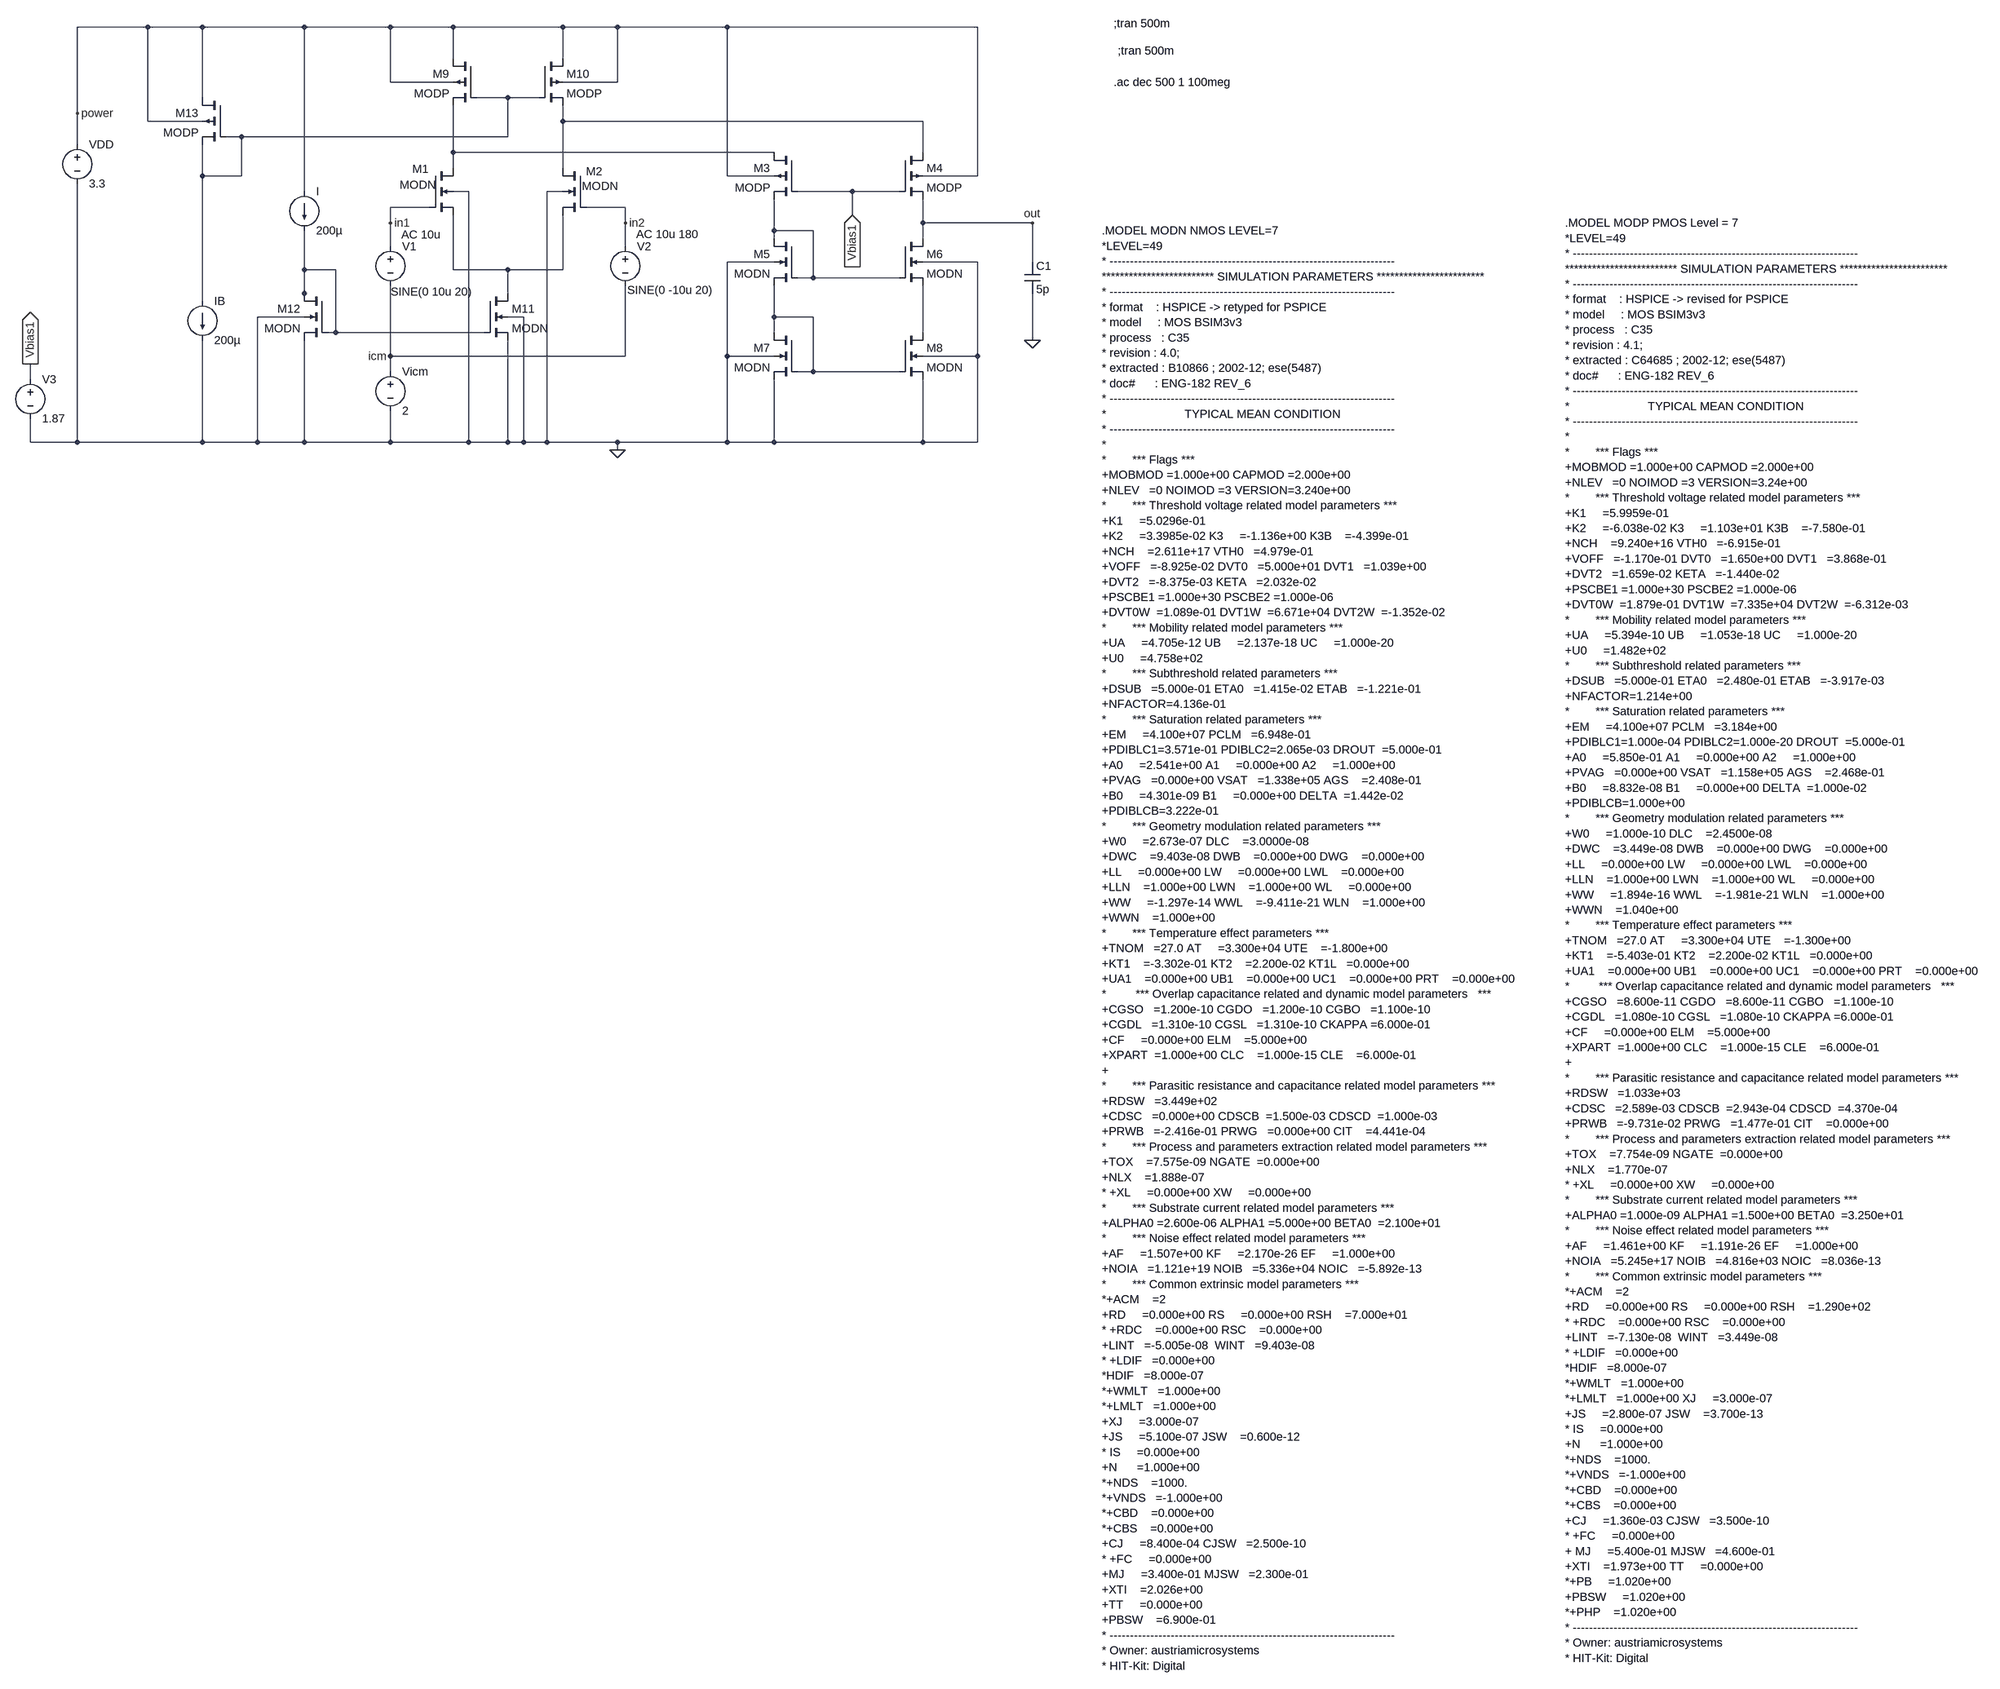
[diagram p0: schematic MyOta.asc]
MyOta.asc, the LTspice schematic file:
Version 4
SHEET 1 2372 2896
WIRE -1664 -192 -1808 -192
WIRE -1552 -192 -1664 -192
WIRE -1344 -192 -1552 -192
WIRE -1168 -192 -1344 -192
WIRE -1040 -192 -1168 -192
WIRE -928 -192 -1040 -192
WIRE -816 -192 -928 -192
WIRE -704 -192 -816 -192
WIRE -480 -192 -704 -192
WIRE 32 -192 -480 -192
WIRE -1808 -128 -1808 -192
WIRE -1040 -128 -1040 -192
WIRE -816 -128 -816 -192
WIRE -1552 -96 -1552 -192
WIRE -1168 -80 -1168 -192
WIRE -1040 -80 -1168 -80
WIRE -704 -80 -704 -192
WIRE -704 -80 -816 -80
WIRE -1552 -48 -1552 -96
WIRE -928 -48 -992 -48
WIRE -864 -48 -928 -48
WIRE -1808 -16 -1808 -128
WIRE -1040 -16 -1040 -32
WIRE -816 -16 -816 -32
WIRE -1664 0 -1664 -192
WIRE -1552 0 -1664 0
WIRE -816 0 -816 -16
WIRE -592 0 -816 0
WIRE -112 0 -592 0
WIRE -80 0 -112 0
WIRE -1472 32 -1504 32
WIRE -928 32 -928 -48
WIRE -928 32 -1472 32
WIRE -1808 48 -1808 -16
WIRE -1040 64 -1040 -16
WIRE -592 64 -1040 64
WIRE -432 64 -592 64
WIRE -384 64 -432 64
WIRE -80 64 -80 0
WIRE -1040 96 -1040 64
WIRE -816 96 -816 0
WIRE -1552 112 -1552 48
WIRE -1472 112 -1472 32
WIRE -1472 112 -1552 112
WIRE -480 112 -480 -192
WIRE -384 112 -480 112
WIRE 32 112 32 -192
WIRE 32 112 -80 112
WIRE -1344 144 -1344 -192
WIRE -1008 144 -1040 144
WIRE -816 144 -848 144
WIRE -224 144 -336 144
WIRE -128 144 -224 144
WIRE -1152 176 -1168 176
WIRE -1088 176 -1152 176
WIRE -704 176 -768 176
WIRE -688 176 -704 176
WIRE -224 192 -224 144
WIRE -1168 208 -1168 176
WIRE -688 208 -688 176
WIRE -384 208 -384 160
WIRE -80 208 -80 160
WIRE 32 208 -80 208
WIRE 144 208 32 208
WIRE -384 224 -384 208
WIRE -304 224 -384 224
WIRE -384 240 -384 224
WIRE -80 240 -80 208
WIRE -1168 256 -1168 208
WIRE -1040 256 -1040 192
WIRE -816 256 -816 192
WIRE -688 256 -688 208
WIRE -384 288 -480 288
WIRE 32 288 -80 288
WIRE 144 288 144 208
WIRE -1344 304 -1344 224
WIRE -1280 304 -1344 304
WIRE -1040 304 -1040 256
WIRE -928 304 -1040 304
WIRE -816 304 -816 256
WIRE -816 304 -928 304
WIRE -304 320 -304 224
WIRE -304 320 -336 320
WIRE -224 320 -304 320
WIRE -128 320 -224 320
WIRE -1344 352 -1344 304
WIRE -928 352 -928 304
WIRE -1552 368 -1552 112
WIRE -1344 368 -1344 352
WIRE -384 368 -384 336
WIRE -80 368 -80 336
WIRE -1344 400 -1440 400
WIRE -896 400 -928 400
WIRE -384 400 -384 368
WIRE -304 400 -384 400
WIRE -1280 432 -1280 304
WIRE -1280 432 -1296 432
WIRE -1088 432 -1280 432
WIRE -976 432 -1088 432
WIRE -384 432 -384 400
WIRE -80 432 -80 368
WIRE 144 448 144 352
WIRE -1168 480 -1168 336
WIRE -688 480 -688 336
WIRE -688 480 -1168 480
WIRE -480 480 -480 288
WIRE -384 480 -480 480
WIRE 32 480 32 288
WIRE 32 480 -80 480
WIRE -1168 512 -1168 480
WIRE -304 512 -304 400
WIRE -304 512 -336 512
WIRE -224 512 -304 512
WIRE -128 512 -224 512
WIRE -1904 528 -1904 496
WIRE -1344 528 -1344 448
WIRE -928 560 -928 448
WIRE -1904 656 -1904 608
WIRE -1808 656 -1808 128
WIRE -1808 656 -1904 656
WIRE -1552 656 -1552 448
WIRE -1552 656 -1808 656
WIRE -1440 656 -1440 400
WIRE -1440 656 -1552 656
WIRE -1344 656 -1344 528
WIRE -1344 656 -1440 656
WIRE -1168 656 -1168 592
WIRE -1168 656 -1344 656
WIRE -1008 656 -1008 144
WIRE -1008 656 -1168 656
WIRE -928 656 -928 560
WIRE -928 656 -1008 656
WIRE -896 656 -896 400
WIRE -896 656 -928 656
WIRE -848 656 -848 144
WIRE -848 656 -896 656
WIRE -704 656 -848 656
WIRE -480 656 -480 480
WIRE -480 656 -704 656
WIRE -384 656 -384 528
WIRE -384 656 -480 656
WIRE -80 656 -80 528
WIRE -80 656 -384 656
WIRE 32 656 32 480
WIRE 32 656 -80 656
WIRE -704 672 -704 656
FLAG -704 672 0
FLAG -224 192 Vbias1
IOPIN -224 192 In
FLAG 144 208 out
FLAG -1904 496 Vbias1
IOPIN -1904 496 Out
FLAG 144 448 0
FLAG -688 208 in2
FLAG -1168 208 in1
FLAG -1168 480 icm
FLAG -1808 -16 power
DATAFLAG -592 0 "round(-Is(M4)*1meg)/1meg"
DATAFLAG -592 64 "round(-Is(M3)*1meg)/1meg"
DATAFLAG -816 256 "round(-Is(M2)*1meg)/1meg"
DATAFLAG -1040 256 "round(-Is(M1)*1meg)/1meg"
DATAFLAG -1040 -16 "round(Id(M9)*1meg)/1meg"
DATAFLAG -816 -16 "round(Id(M10)*1meg)/1meg"
DATAFLAG -928 560 "round(Id(M11)*1meg)/1meg"
DATAFLAG -384 208 "round(-Is(M5)*1meg)/1meg"
DATAFLAG -1344 528 "round(Id(M12)*1meg)/1meg"
DATAFLAG -80 368 "round(-Is(M8)*1meg)/1meg"
DATAFLAG -384 368 "round(-Is(M7)*1meg)/1meg"
DATAFLAG -1552 -96 "round(-Is(M13)*1meg)/1meg"
DATAFLAG -928 304 "round(V(n005)*100)/100"
DATAFLAG -432 64 "round(V(n002)*100)/100"
DATAFLAG -112 0 "round(V(n003)*100)/100"
DATAFLAG -1088 432 "round(V(n006)*100)/100"
DATAFLAG -224 512 "round(V(n007)*100)/100"
DATAFLAG -224 320 "round(V(n004)*100)/100"
DATAFLAG 32 208 "round(V(out)*100)/100"
DATAFLAG -928 -192 ""
DATAFLAG -224 144 ""
DATAFLAG -928 -48 "round(V(n001)*100)/100"
DATAFLAG -704 176 ""
DATAFLAG -1152 176 ""
DATAFLAG -1808 -128 "-round(I(Vdd)*1meg)/1meg"
SYMBOL nmos4 -768 96 M0
WINDOW 0 -34 7 Left 2
WINDOW 3 -65 37 Left 2
SYMATTR InstName M2
SYMATTR Value MODN
SYMATTR Value2 l=1.4u w=36.4u
SYMBOL nmos4 -1088 96 R0
WINDOW 0 -35 2 Left 2
WINDOW 3 -61 34 Left 2
SYMATTR InstName M1
SYMATTR Value MODN
SYMATTR Value2 l=1.4u w=36.4u
SYMBOL pmos4 -128 64 R0
SYMATTR InstName M4
SYMATTR Value MODP
SYMATTR Value2 l=1.4u w=92.4u
SYMBOL nmos4 -128 240 R0
SYMATTR InstName M6
SYMATTR Value MODN
SYMATTR Value2 l=1.4u w=36.4u
SYMBOL nmos4 -128 432 R0
SYMATTR InstName M8
SYMATTR Value MODN
SYMATTR Value2 l=1.4u w=36.4u
SYMBOL pmos4 -864 -128 R0
SYMATTR InstName M10
SYMATTR Value MODP
SYMATTR Value2 l=1.4u w=184.8u
SYMBOL nmos4 -976 352 R0
SYMATTR InstName M11
SYMATTR Value MODN
SYMATTR Value2 l=1.4u w=72.8u
SYMBOL voltage -1808 32 R0
WINDOW 123 0 0 Left 2
WINDOW 39 0 0 Left 2
SYMATTR InstName VDD
SYMATTR Value 3.3
SYMBOL pmos4 -336 64 M0
SYMATTR InstName M3
SYMATTR Value MODP
SYMATTR Value2 l=1.4u w=92.4u
SYMBOL pmos4 -992 -128 M0
SYMATTR InstName M9
SYMATTR Value MODP
SYMATTR Value2 l=1.4u w=184.8u
SYMBOL nmos4 -336 240 M0
SYMATTR InstName M5
SYMATTR Value MODN
SYMATTR Value2 l=1.4u w=36.4u
SYMBOL nmos4 -336 432 M0
SYMATTR InstName M7
SYMATTR Value MODN
SYMATTR Value2 l=1.4u w=36.4u
SYMBOL nmos4 -1296 352 M0
SYMATTR InstName M12
SYMATTR Value MODN
SYMATTR Value2 l=1.4u w=72.8u
SYMBOL current -1344 144 R0
WINDOW 123 0 0 Left 2
WINDOW 39 0 0 Left 2
SYMATTR InstName I
SYMATTR Value 200µ
SYMBOL pmos4 -1504 -48 M0
SYMATTR InstName M13
SYMATTR Value MODP
SYMATTR Value2 l=1.4u w=184.8u
SYMBOL current -1552 368 R0
WINDOW 123 0 0 Left 2
WINDOW 39 0 0 Left 2
SYMATTR InstName IB
SYMATTR Value 200µ
SYMBOL voltage -1168 496 R0
WINDOW 123 24 124 Left 2
WINDOW 39 0 0 Left 2
SYMATTR InstName Vicm
SYMATTR Value 2
SYMBOL voltage -1168 240 R0
WINDOW 123 22 -8 Left 2
WINDOW 39 0 0 Left 2
WINDOW 3 1 109 Left 2
SYMATTR Value2 AC 10u
SYMATTR Value SINE(0 10u 20)
SYMATTR InstName V1
SYMBOL voltage -688 240 R0
WINDOW 3 4 105 Left 2
WINDOW 123 22 -9 Left 2
WINDOW 39 0 0 Left 2
SYMATTR Value SINE(0 -10u 20)
SYMATTR Value2 AC 10u 180
SYMATTR InstName V2
SYMBOL voltage -1904 512 R0
WINDOW 123 0 0 Left 2
WINDOW 39 0 0 Left 2
SYMATTR InstName V3
SYMATTR Value 1.87
SYMBOL cap 128 288 R0
SYMATTR InstName C1
SYMATTR Value 5p
TEXT 448 224 Left 2 !.MODEL MODN NMOS LEVEL=7\n*LEVEL=49 \n* ----------------------------------------------------------------------\n************************* SIMULATION PARAMETERS ************************\n* ----------------------------------------------------------------------\n* format    : HSPICE -> retyped for PSPICE\n* model     : MOS BSIM3v3\n* process   : C35\n* revision : 4.0; \n* extracted : B10866 ; 2002-12; ese(5487)\n* doc#      : ENG-182 REV_6\n* ----------------------------------------------------------------------\n*                        TYPICAL MEAN CONDITION\n* ----------------------------------------------------------------------\n*\n*        *** Flags ***\n+MOBMOD =1.000e+00 CAPMOD =2.000e+00 \n+NLEV   =0 NOIMOD =3 VERSION=3.240e+00 \n*        *** Threshold voltage related model parameters ***\n+K1     =5.0296e-01 \n+K2     =3.3985e-02 K3     =-1.136e+00 K3B    =-4.399e-01 \n+NCH    =2.611e+17 VTH0   =4.979e-01 \n+VOFF   =-8.925e-02 DVT0   =5.000e+01 DVT1   =1.039e+00 \n+DVT2   =-8.375e-03 KETA   =2.032e-02 \n+PSCBE1 =1.000e+30 PSCBE2 =1.000e-06 \n+DVT0W  =1.089e-01 DVT1W  =6.671e+04 DVT2W  =-1.352e-02 \n*        *** Mobility related model parameters ***\n+UA     =4.705e-12 UB     =2.137e-18 UC     =1.000e-20 \n+U0     =4.758e+02 \n*        *** Subthreshold related parameters ***\n+DSUB   =5.000e-01 ETA0   =1.415e-02 ETAB   =-1.221e-01 \n+NFACTOR=4.136e-01 \n*        *** Saturation related parameters ***\n+EM     =4.100e+07 PCLM   =6.948e-01 \n+PDIBLC1=3.571e-01 PDIBLC2=2.065e-03 DROUT  =5.000e-01 \n+A0     =2.541e+00 A1     =0.000e+00 A2     =1.000e+00 \n+PVAG   =0.000e+00 VSAT   =1.338e+05 AGS    =2.408e-01 \n+B0     =4.301e-09 B1     =0.000e+00 DELTA  =1.442e-02 \n+PDIBLCB=3.222e-01 \n*        *** Geometry modulation related parameters ***\n+W0     =2.673e-07 DLC    =3.0000e-08 \n+DWC    =9.403e-08 DWB    =0.000e+00 DWG    =0.000e+00 \n+LL     =0.000e+00 LW     =0.000e+00 LWL    =0.000e+00 \n+LLN    =1.000e+00 LWN    =1.000e+00 WL     =0.000e+00 \n+WW     =-1.297e-14 WWL    =-9.411e-21 WLN    =1.000e+00 \n+WWN    =1.000e+00 \n*        *** Temperature effect parameters ***\n+TNOM   =27.0 AT     =3.300e+04 UTE    =-1.800e+00 \n+KT1    =-3.302e-01 KT2    =2.200e-02 KT1L   =0.000e+00 \n+UA1    =0.000e+00 UB1    =0.000e+00 UC1    =0.000e+00 PRT    =0.000e+00 \n*         *** Overlap capacitance related and dynamic model parameters   ***\n+CGSO   =1.200e-10 CGDO   =1.200e-10 CGBO   =1.100e-10 \n+CGDL   =1.310e-10 CGSL   =1.310e-10 CKAPPA =6.000e-01 \n+CF     =0.000e+00 ELM    =5.000e+00 \n+XPART  =1.000e+00 CLC    =1.000e-15 CLE    =6.000e-01 \n+\n*        *** Parasitic resistance and capacitance related model parameters ***\n+RDSW   =3.449e+02 \n+CDSC   =0.000e+00 CDSCB  =1.500e-03 CDSCD  =1.000e-03 \n+PRWB   =-2.416e-01 PRWG   =0.000e+00 CIT    =4.441e-04 \n*        *** Process and parameters extraction related model parameters ***\n+TOX    =7.575e-09 NGATE  =0.000e+00 \n+NLX    =1.888e-07 \n* +XL     =0.000e+00 XW     =0.000e+00 \n*        *** Substrate current related model parameters ***\n+ALPHA0 =2.600e-06 ALPHA1 =5.000e+00 BETA0  =2.100e+01 \n*        *** Noise effect related model parameters ***\n+AF     =1.507e+00 KF     =2.170e-26 EF     =1.000e+00 \n+NOIA   =1.121e+19 NOIB   =5.336e+04 NOIC   =-5.892e-13 \n*        *** Common extrinsic model parameters ***\n*+ACM    =2        \n+RD     =0.000e+00 RS     =0.000e+00 RSH    =7.000e+01 \n* +RDC    =0.000e+00 RSC    =0.000e+00 \n+LINT   =-5.005e-08  WINT   =9.403e-08 \n* +LDIF   =0.000e+00 \n*HDIF   =8.000e-07\n*+WMLT   =1.000e+00 \n*+LMLT   =1.000e+00 \n+XJ     =3.000e-07 \n+JS     =5.100e-07 JSW    =0.600e-12 \n* IS     =0.000e+00 \n+N      =1.000e+00 \n*+NDS    =1000. \n*+VNDS   =-1.000e+00 \n*+CBD    =0.000e+00 \n*+CBS    =0.000e+00 \n+CJ     =8.400e-04 CJSW   =2.500e-10 \n* +FC     =0.000e+00 \n+MJ     =3.400e-01 MJSW   =2.300e-01 \n+XTI    =2.026e+00 \n+TT     =0.000e+00 \n+PBSW    =6.900e-01 \n* ----------------------------------------------------------------------\n* Owner: austriamicrosystems\n* HIT-Kit: Digital
TEXT 1408 208 Left 2 !.MODEL MODP PMOS Level = 7\n*LEVEL=49 \n* ----------------------------------------------------------------------\n************************* SIMULATION PARAMETERS ************************\n* ----------------------------------------------------------------------\n* format    : HSPICE -> revised for PSPICE\n* model     : MOS BSIM3v3\n* process   : C35\n* revision : 4.1; \n* extracted : C64685 ; 2002-12; ese(5487)\n* doc#      : ENG-182 REV_6\n* ----------------------------------------------------------------------\n*                        TYPICAL MEAN CONDITION\n* ----------------------------------------------------------------------\n*\n*        *** Flags ***\n+MOBMOD =1.000e+00 CAPMOD =2.000e+00 \n+NLEV   =0 NOIMOD =3 VERSION=3.24e+00 \n*        *** Threshold voltage related model parameters ***\n+K1     =5.9959e-01 \n+K2     =-6.038e-02 K3     =1.103e+01 K3B    =-7.580e-01 \n+NCH    =9.240e+16 VTH0   =-6.915e-01 \n+VOFF   =-1.170e-01 DVT0   =1.650e+00 DVT1   =3.868e-01 \n+DVT2   =1.659e-02 KETA   =-1.440e-02 \n+PSCBE1 =1.000e+30 PSCBE2 =1.000e-06 \n+DVT0W  =1.879e-01 DVT1W  =7.335e+04 DVT2W  =-6.312e-03 \n*        *** Mobility related model parameters ***\n+UA     =5.394e-10 UB     =1.053e-18 UC     =1.000e-20 \n+U0     =1.482e+02 \n*        *** Subthreshold related parameters ***\n+DSUB   =5.000e-01 ETA0   =2.480e-01 ETAB   =-3.917e-03 \n+NFACTOR=1.214e+00 \n*        *** Saturation related parameters ***\n+EM     =4.100e+07 PCLM   =3.184e+00 \n+PDIBLC1=1.000e-04 PDIBLC2=1.000e-20 DROUT  =5.000e-01 \n+A0     =5.850e-01 A1     =0.000e+00 A2     =1.000e+00 \n+PVAG   =0.000e+00 VSAT   =1.158e+05 AGS    =2.468e-01 \n+B0     =8.832e-08 B1     =0.000e+00 DELTA  =1.000e-02 \n+PDIBLCB=1.000e+00 \n*        *** Geometry modulation related parameters ***\n+W0     =1.000e-10 DLC    =2.4500e-08 \n+DWC    =3.449e-08 DWB    =0.000e+00 DWG    =0.000e+00 \n+LL     =0.000e+00 LW     =0.000e+00 LWL    =0.000e+00 \n+LLN    =1.000e+00 LWN    =1.000e+00 WL     =0.000e+00 \n+WW     =1.894e-16 WWL    =-1.981e-21 WLN    =1.000e+00 \n+WWN    =1.040e+00 \n*        *** Temperature effect parameters ***\n+TNOM   =27.0 AT     =3.300e+04 UTE    =-1.300e+00 \n+KT1    =-5.403e-01 KT2    =2.200e-02 KT1L   =0.000e+00 \n+UA1    =0.000e+00 UB1    =0.000e+00 UC1    =0.000e+00 PRT    =0.000e+00 \n*         *** Overlap capacitance related and dynamic model parameters   ***\n+CGSO   =8.600e-11 CGDO   =8.600e-11 CGBO   =1.100e-10 \n+CGDL   =1.080e-10 CGSL   =1.080e-10 CKAPPA =6.000e-01 \n+CF     =0.000e+00 ELM    =5.000e+00 \n+XPART  =1.000e+00 CLC    =1.000e-15 CLE    =6.000e-01 \n+\n*        *** Parasitic resistance and capacitance related model parameters ***\n+RDSW   =1.033e+03 \n+CDSC   =2.589e-03 CDSCB  =2.943e-04 CDSCD  =4.370e-04 \n+PRWB   =-9.731e-02 PRWG   =1.477e-01 CIT    =0.000e+00 \n*        *** Process and parameters extraction related model parameters ***\n+TOX    =7.754e-09 NGATE  =0.000e+00 \n+NLX    =1.770e-07 \n* +XL     =0.000e+00 XW     =0.000e+00 \n*        *** Substrate current related model parameters ***\n+ALPHA0 =1.000e-09 ALPHA1 =1.500e+00 BETA0  =3.250e+01 \n*        *** Noise effect related model parameters ***\n+AF     =1.461e+00 KF     =1.191e-26 EF     =1.000e+00 \n+NOIA   =5.245e+17 NOIB   =4.816e+03 NOIC   =8.036e-13 \n*        *** Common extrinsic model parameters ***\n*+ACM    =2        \n+RD     =0.000e+00 RS     =0.000e+00 RSH    =1.290e+02 \n* +RDC    =0.000e+00 RSC    =0.000e+00 \n+LINT   =-7.130e-08  WINT   =3.449e-08 \n* +LDIF   =0.000e+00\n*HDIF   =8.000e-07 \n*+WMLT   =1.000e+00 \n*+LMLT   =1.000e+00 XJ     =3.000e-07 \n+JS     =2.800e-07 JSW    =3.700e-13 \n* IS     =0.000e+00 \n+N      =1.000e+00 \n*+NDS    =1000. \n*+VNDS   =-1.000e+00 \n*+CBD    =0.000e+00 \n*+CBS    =0.000e+00 \n+CJ     =1.360e-03 CJSW   =3.500e-10 \n* +FC     =0.000e+00 \n+ MJ     =5.400e-01 MJSW   =4.600e-01 \n+XTI    =1.973e+00 TT     =0.000e+00 \n*+PB     =1.020e+00 \n+PBSW     =1.020e+00\n*+PHP    =1.020e+00 \n* ----------------------------------------------------------------------\n* Owner: austriamicrosystems\n* HIT-Kit: Digital
TEXT 472 -200 Left 2 !;tran 500m
TEXT 480 -144 Left 2 !;tran 500m
TEXT 472 -80 Left 2 !.ac dec 500 1 100meg

The netlist it stands for:
* MyOta.asc
M2 N003 in2 N005 0 MODN l=1.4u w=36.4u
M1 N002 in1 N005 0 MODN l=1.4u w=36.4u
M4 N003 Vbias1 out power MODP l=1.4u w=92.4u
M6 out N004 N008 0 MODN l=1.4u w=36.4u
M8 N008 N007 0 0 MODN l=1.4u w=36.4u
M10 power N001 N003 power MODP l=1.4u w=184.8u
M11 N005 N006 0 0 MODN l=1.4u w=72.8u
VDD power 0 3.3
M3 N002 Vbias1 N004 power MODP l=1.4u w=92.4u
M9 power N001 N002 power MODP l=1.4u w=184.8u
M5 N004 N004 N007 0 MODN l=1.4u w=36.4u
M7 N007 N007 0 0 MODN l=1.4u w=36.4u
M12 N006 N006 0 0 MODN l=1.4u w=72.8u
I power N006 200µ
M13 power N001 N001 power MODP l=1.4u w=184.8u
IB N001 0 200µ
Vicm icm 0 2
V1 in1 icm SINE(0 10u 20) AC 10u
V2 in2 icm SINE(0 -10u 20) AC 10u 180
V3 Vbias1 0 1.87
C1 out 0 5p
.model NMOS NMOS
.model PMOS PMOS
.lib standard.mos
.MODEL MODN NMOS LEVEL=7
*LEVEL=49
* ----------------------------------------------------------------------
************************* SIMULATION PARAMETERS ************************
* ----------------------------------------------------------------------
* format    : HSPICE -> retyped for PSPICE
* model     : MOS BSIM3v3
* process   : C35
* revision : 4.0;
* extracted : B10866 ; 2002-12; ese(5487)
* doc#      : ENG-182 REV_6
* ----------------------------------------------------------------------
*                        TYPICAL MEAN CONDITION
* ----------------------------------------------------------------------
*
*        *** Flags ***
+MOBMOD =1.000e+00 CAPMOD =2.000e+00
+NLEV   =0 NOIMOD =3 VERSION=3.240e+00
*        *** Threshold voltage related model parameters ***
+K1     =5.0296e-01
+K2     =3.3985e-02 K3     =-1.136e+00 K3B    =-4.399e-01
+NCH    =2.611e+17 VTH0   =4.979e-01
+VOFF   =-8.925e-02 DVT0   =5.000e+01 DVT1   =1.039e+00
+DVT2   =-8.375e-03 KETA   =2.032e-02
+PSCBE1 =1.000e+30 PSCBE2 =1.000e-06
+DVT0W  =1.089e-01 DVT1W  =6.671e+04 DVT2W  =-1.352e-02
*        *** Mobility related model parameters ***
+UA     =4.705e-12 UB     =2.137e-18 UC     =1.000e-20
+U0     =4.758e+02
*        *** Subthreshold related parameters ***
+DSUB   =5.000e-01 ETA0   =1.415e-02 ETAB   =-1.221e-01
+NFACTOR=4.136e-01
*        *** Saturation related parameters ***
+EM     =4.100e+07 PCLM   =6.948e-01
+PDIBLC1=3.571e-01 PDIBLC2=2.065e-03 DROUT  =5.000e-01
+A0     =2.541e+00 A1     =0.000e+00 A2     =1.000e+00
+PVAG   =0.000e+00 VSAT   =1.338e+05 AGS    =2.408e-01
+B0     =4.301e-09 B1     =0.000e+00 DELTA  =1.442e-02
+PDIBLCB=3.222e-01
*        *** Geometry modulation related parameters ***
+W0     =2.673e-07 DLC    =3.0000e-08
+DWC    =9.403e-08 DWB    =0.000e+00 DWG    =0.000e+00
+LL     =0.000e+00 LW     =0.000e+00 LWL    =0.000e+00
+LLN    =1.000e+00 LWN    =1.000e+00 WL     =0.000e+00
+WW     =-1.297e-14 WWL    =-9.411e-21 WLN    =1.000e+00
+WWN    =1.000e+00
*        *** Temperature effect parameters ***
+TNOM   =27.0 AT     =3.300e+04 UTE    =-1.800e+00
+KT1    =-3.302e-01 KT2    =2.200e-02 KT1L   =0.000e+00
+UA1    =0.000e+00 UB1    =0.000e+00 UC1    =0.000e+00 PRT    =0.000e+00
*         *** Overlap capacitance related and dynamic model parameters   ***
+CGSO   =1.200e-10 CGDO   =1.200e-10 CGBO   =1.100e-10
+CGDL   =1.310e-10 CGSL   =1.310e-10 CKAPPA =6.000e-01
+CF     =0.000e+00 ELM    =5.000e+00
+XPART  =1.000e+00 CLC    =1.000e-15 CLE    =6.000e-01
+
*        *** Parasitic resistance and capacitance related model parameters ***
+RDSW   =3.449e+02
+CDSC   =0.000e+00 CDSCB  =1.500e-03 CDSCD  =1.000e-03
+PRWB   =-2.416e-01 PRWG   =0.000e+00 CIT    =4.441e-04
*        *** Process and parameters extraction related model parameters ***
+TOX    =7.575e-09 NGATE  =0.000e+00
+NLX    =1.888e-07
* +XL     =0.000e+00 XW     =0.000e+00
*        *** Substrate current related model parameters ***
+ALPHA0 =2.600e-06 ALPHA1 =5.000e+00 BETA0  =2.100e+01
*        *** Noise effect related model parameters ***
+AF     =1.507e+00 KF     =2.170e-26 EF     =1.000e+00
+NOIA   =1.121e+19 NOIB   =5.336e+04 NOIC   =-5.892e-13
*        *** Common extrinsic model parameters ***
*+ACM    =2
+RD     =0.000e+00 RS     =0.000e+00 RSH    =7.000e+01
* +RDC    =0.000e+00 RSC    =0.000e+00
+LINT   =-5.005e-08  WINT   =9.403e-08
* +LDIF   =0.000e+00
*HDIF   =8.000e-07
*+WMLT   =1.000e+00
*+LMLT   =1.000e+00
+XJ     =3.000e-07
+JS     =5.100e-07 JSW    =0.600e-12
* IS     =0.000e+00
+N      =1.000e+00
*+NDS    =1000.
*+VNDS   =-1.000e+00
*+CBD    =0.000e+00
*+CBS    =0.000e+00
+CJ     =8.400e-04 CJSW   =2.500e-10
* +FC     =0.000e+00
+MJ     =3.400e-01 MJSW   =2.300e-01
+XTI    =2.026e+00
+TT     =0.000e+00
+PBSW    =6.900e-01
* ----------------------------------------------------------------------
* Owner: austriamicrosystems
* HIT-Kit: Digital
.MODEL MODP PMOS Level = 7
*LEVEL=49
* ----------------------------------------------------------------------
************************* SIMULATION PARAMETERS ************************
* ----------------------------------------------------------------------
* format    : HSPICE -> revised for PSPICE
* model     : MOS BSIM3v3
* process   : C35
* revision : 4.1;
* extracted : C64685 ; 2002-12; ese(5487)
* doc#      : ENG-182 REV_6
* ----------------------------------------------------------------------
*                        TYPICAL MEAN CONDITION
* ----------------------------------------------------------------------
*
*        *** Flags ***
+MOBMOD =1.000e+00 CAPMOD =2.000e+00
+NLEV   =0 NOIMOD =3 VERSION=3.24e+00
*        *** Threshold voltage related model parameters ***
+K1     =5.9959e-01
+K2     =-6.038e-02 K3     =1.103e+01 K3B    =-7.580e-01
+NCH    =9.240e+16 VTH0   =-6.915e-01
+VOFF   =-1.170e-01 DVT0   =1.650e+00 DVT1   =3.868e-01
+DVT2   =1.659e-02 KETA   =-1.440e-02
+PSCBE1 =1.000e+30 PSCBE2 =1.000e-06
+DVT0W  =1.879e-01 DVT1W  =7.335e+04 DVT2W  =-6.312e-03
*        *** Mobility related model parameters ***
+UA     =5.394e-10 UB     =1.053e-18 UC     =1.000e-20
+U0     =1.482e+02
*        *** Subthreshold related parameters ***
+DSUB   =5.000e-01 ETA0   =2.480e-01 ETAB   =-3.917e-03
+NFACTOR=1.214e+00
*        *** Saturation related parameters ***
+EM     =4.100e+07 PCLM   =3.184e+00
+PDIBLC1=1.000e-04 PDIBLC2=1.000e-20 DROUT  =5.000e-01
+A0     =5.850e-01 A1     =0.000e+00 A2     =1.000e+00
+PVAG   =0.000e+00 VSAT   =1.158e+05 AGS    =2.468e-01
+B0     =8.832e-08 B1     =0.000e+00 DELTA  =1.000e-02
+PDIBLCB=1.000e+00
*        *** Geometry modulation related parameters ***
+W0     =1.000e-10 DLC    =2.4500e-08
+DWC    =3.449e-08 DWB    =0.000e+00 DWG    =0.000e+00
+LL     =0.000e+00 LW     =0.000e+00 LWL    =0.000e+00
+LLN    =1.000e+00 LWN    =1.000e+00 WL     =0.000e+00
+WW     =1.894e-16 WWL    =-1.981e-21 WLN    =1.000e+00
+WWN    =1.040e+00
*        *** Temperature effect parameters ***
+TNOM   =27.0 AT     =3.300e+04 UTE    =-1.300e+00
+KT1    =-5.403e-01 KT2    =2.200e-02 KT1L   =0.000e+00
+UA1    =0.000e+00 UB1    =0.000e+00 UC1    =0.000e+00 PRT    =0.000e+00
*         *** Overlap capacitance related and dynamic model parameters   ***
+CGSO   =8.600e-11 CGDO   =8.600e-11 CGBO   =1.100e-10
+CGDL   =1.080e-10 CGSL   =1.080e-10 CKAPPA =6.000e-01
+CF     =0.000e+00 ELM    =5.000e+00
+XPART  =1.000e+00 CLC    =1.000e-15 CLE    =6.000e-01
+
*        *** Parasitic resistance and capacitance related model parameters ***
+RDSW   =1.033e+03
+CDSC   =2.589e-03 CDSCB  =2.943e-04 CDSCD  =4.370e-04
+PRWB   =-9.731e-02 PRWG   =1.477e-01 CIT    =0.000e+00
*        *** Process and parameters extraction related model parameters ***
+TOX    =7.754e-09 NGATE  =0.000e+00
+NLX    =1.770e-07
* +XL     =0.000e+00 XW     =0.000e+00
*        *** Substrate current related model parameters ***
+ALPHA0 =1.000e-09 ALPHA1 =1.500e+00 BETA0  =3.250e+01
*        *** Noise effect related model parameters ***
+AF     =1.461e+00 KF     =1.191e-26 EF     =1.000e+00
+NOIA   =5.245e+17 NOIB   =4.816e+03 NOIC   =8.036e-13
*        *** Common extrinsic model parameters ***
*+ACM    =2
+RD     =0.000e+00 RS     =0.000e+00 RSH    =1.290e+02
* +RDC    =0.000e+00 RSC    =0.000e+00
+LINT   =-7.130e-08  WINT   =3.449e-08
* +LDIF   =0.000e+00
*HDIF   =8.000e-07
*+WMLT   =1.000e+00
*+LMLT   =1.000e+00 XJ     =3.000e-07
+JS     =2.800e-07 JSW    =3.700e-13
* IS     =0.000e+00
+N      =1.000e+00
*+NDS    =1000.
*+VNDS   =-1.000e+00
*+CBD    =0.000e+00
*+CBS    =0.000e+00
+CJ     =1.360e-03 CJSW   =3.500e-10
* +FC     =0.000e+00
+ MJ     =5.400e-01 MJSW   =4.600e-01
+XTI    =1.973e+00 TT     =0.000e+00
*+PB     =1.020e+00
+PBSW     =1.020e+00
*+PHP    =1.020e+00
* ----------------------------------------------------------------------
* Owner: austriamicrosystems
* HIT-Kit: Digital
;tran 500m
;tran 500m
.ac dec 500 1 100meg
.backanno
.end